# EAGLE design motorcontroller (10.01.2017) (EAGLE 8.3.2)
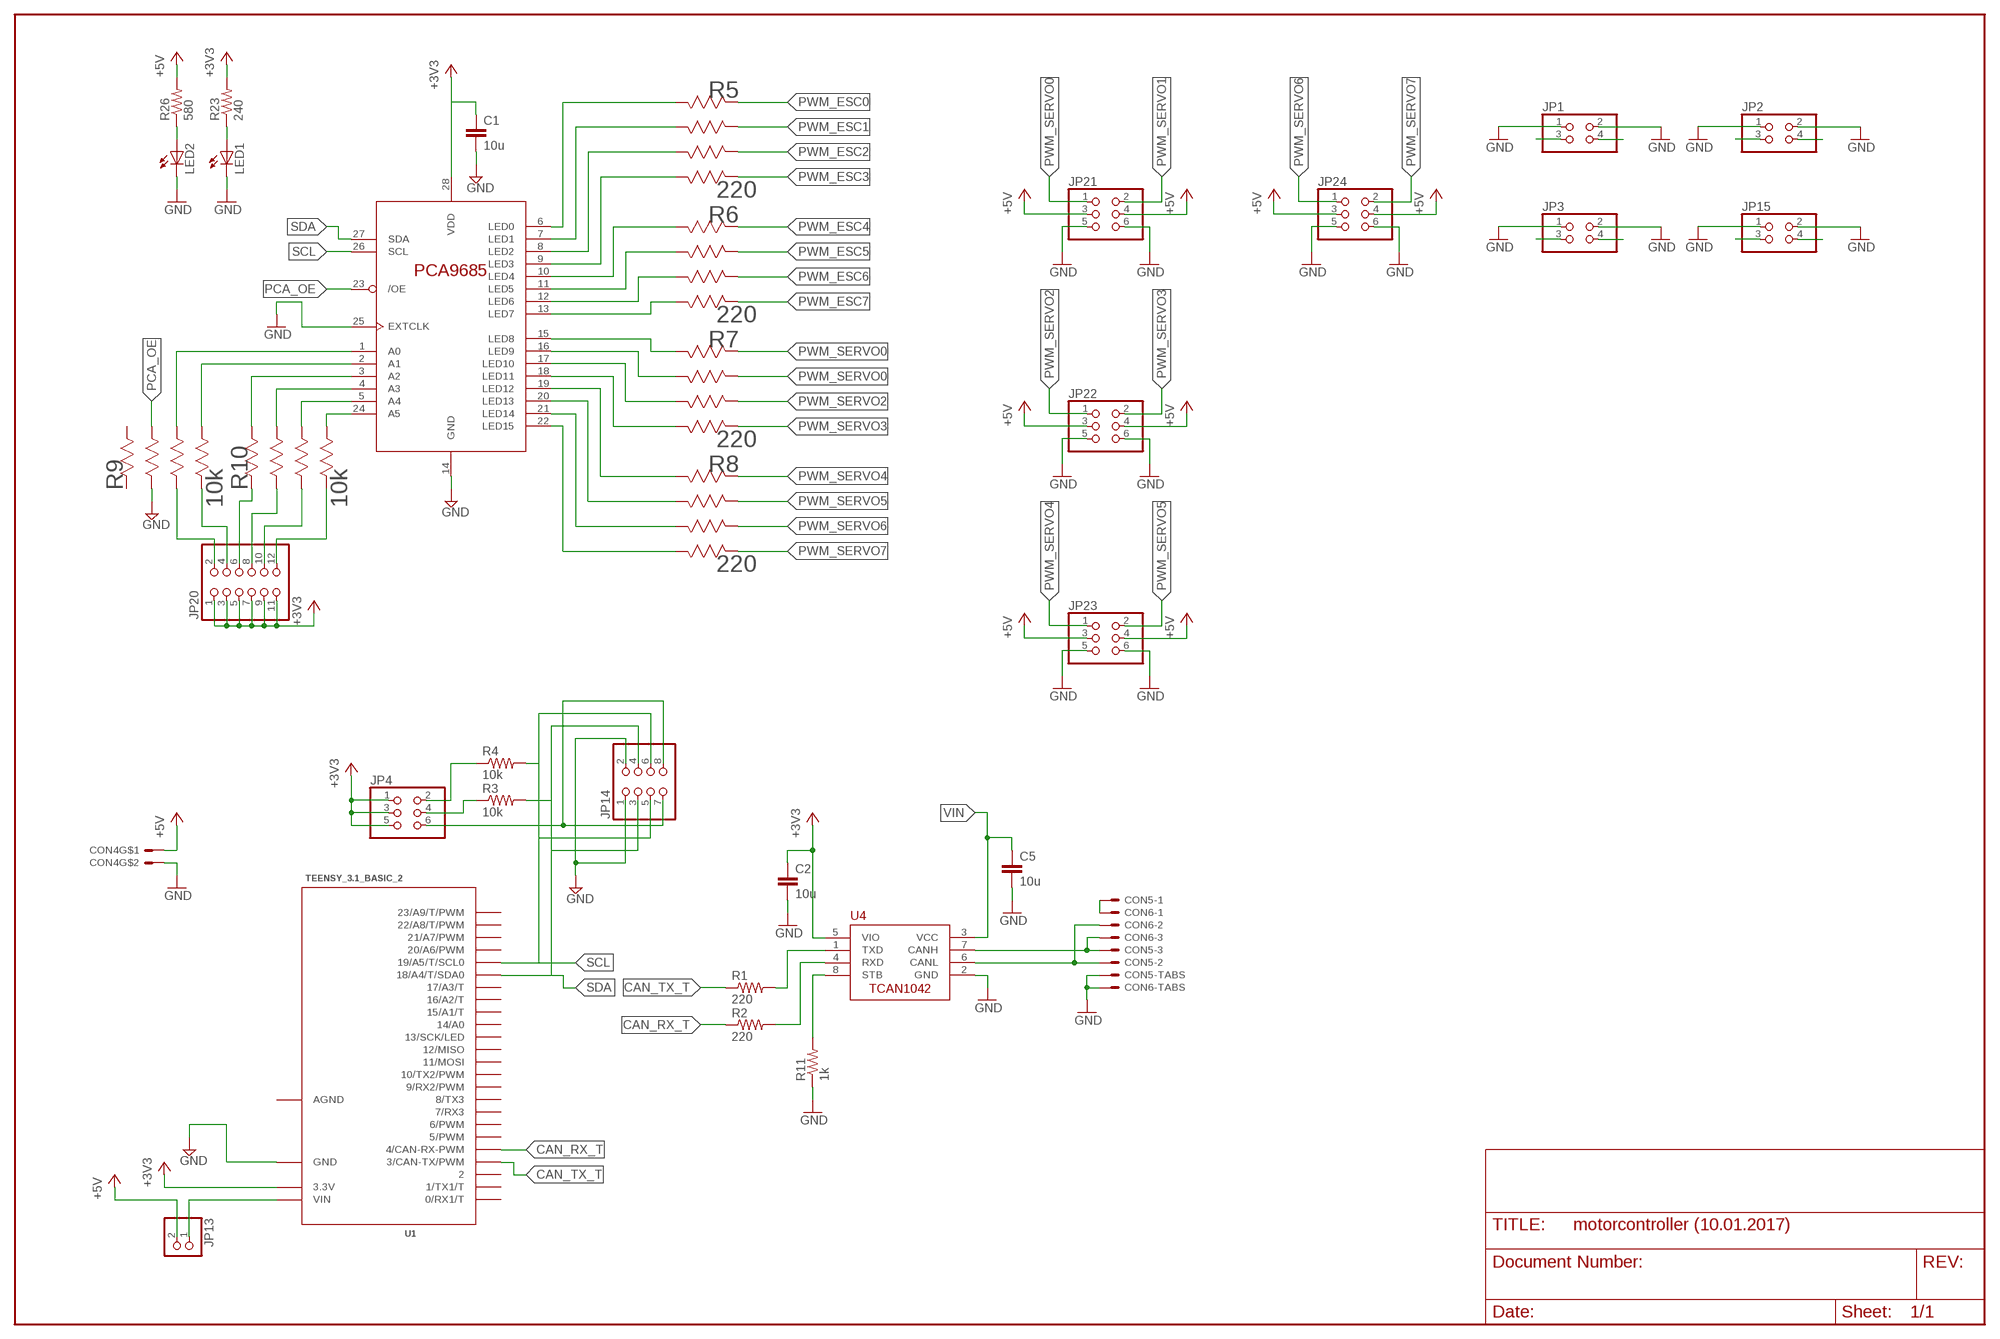
[diagram p0: schematic, sheet 1]

## Parts
C1  10u  C-EUC0805  [C0805]
C2  10u  C-EUC0805  [C0805]
C5  10u  C-EUC0805  [C0805]
CON4  MOLEX_5566-2  [5566-2]
CON5  S3B-PH-SM4-TB  [S3B-PH-SM4-TB]
CON6  S3B-PH-SM4-TB  [S3B-PH-SM4-TB]
JP1  PINHD-2X2  [2X02]
JP2  PINHD-2X2  [2X02]
JP3  PINHD-2X2  [2X02]
JP4  PINHD-2X3  [2X03]
JP13  PINHD-1X2  [1X02]
JP14  PINHD-2X4  [2X04]
JP15  PINHD-2X2  [2X02]
JP20  PINHD-2X6  [2X06]
JP21  PINHD-2X3  [2X03]
JP22  PINHD-2X3  [2X03]
JP23  PINHD-2X3  [2X03]
JP24  PINHD-2X3  [2X03]
LED1  LEDCHIPLED_1206  [CHIPLED_1206]
LED2  LEDCHIPLED_1206  [CHIPLED_1206]
R1  220  R-US_R0805  [R0805]
R2  220  R-US_R0805  [R0805]
R3  10k  R-US_R1206  [R1206]
R4  10k  R-US_R1206  [R1206]
R5  220  EXB-V8V221JVEXBV8V-M  [EXBV8V-M]
R6  220  EXB-V8V221JVEXBV8V-M  [EXBV8V-M]
R7  220  EXB-V8V221JVEXBV8V-M  [EXBV8V-M]
R8  220  EXB-V8V221JVEXBV8V-M  [EXBV8V-M]
R9  10k  EXB-V8V221JVEXBV8V-M  [EXBV8V-M]
R10  10k  EXB-V8V221JVEXBV8V-M  [EXBV8V-M]
R11  1k  R-US_R0805  [R0805]
R23  240  R-US_R1206  [R1206]
R26  580  R-US_R1206  [R1206]
U1  TEENSY_3.1_BASIC_2  [TEENSY_3.1_BASIC_2]
U2  PCA9685PW  [TSSOP28]
U4  TCAN1042HVDR  [SO-8]

## Nets
+3V3: C1.1 C2.1 JP4.1 JP4.3 JP4.5 JP20.1 JP20.3 JP20.5 JP20.7 JP20.9 JP20.11 R23.2 U1.3.3V U2.28(VDD) U4.5(VIO)
+5V: CON4.1 JP13.2 JP21.3 JP21.4 JP22.3 JP22.4 JP23.3 JP23.4 JP24.3 JP24.4 R26.2
A0+1: JP20.2 R9.3
A1+1: JP20.4 R9.4
A2+1: JP20.6 R10.1
A3+1: JP20.8 R10.2
A4+1: JP20.10 R10.3
A5: JP20.12 R10.4
A6: R10.5 U2.24(A5)
A7: R10.6 U2.5(A4)
A8: R10.7 U2.4(A3)
A9: R10.8 U2.3(A2)
A10: R9.5 U2.2(A1)
A11: R9.6 U2.1(A0)
CAN_RX1: R2.2 U4.4(RXD)
CAN_RX_T: R2.1 U1.4(4/CAN-RX-PWM)
CAN_TX2: R1.2 U4.1(TXD)
CAN_TX_T: R1.1 U1.3(3/CAN-TX/PWM)
CANH1: CON5.P$3 CON6.P$3 U4.7(CANH)
CANL1: CON5.P$2 CON6.P$2 U4.6(CANL)
CANSH1: CON5.P$1 CON6.P$1
GND: C1.2 C2.2 C5.2 CON4.2 CON5.P$4 CON5.P$5 CON6.P$4 CON6.P$5 JP1.1 JP1.2 JP2.1 JP2.2 JP3.1 JP3.2 JP14.1 JP14.2 JP15.1 JP15.2 JP21.5 JP21.6 JP22.5 JP22.6 JP23.5 JP23.6 JP24.5 JP24.6 LED1.C LED2.C R9.2 R11.1 U1.GND U2.14(GND) U2.25(EXTCLK) U4.2(GND)
I2C_3V1: JP4.6 JP14.7 JP14.8
N$1: LED1.A R23.1
N$2: LED2.A R26.1
PCA_OE: R9.7 U2.23(/OE)
PWM_CH16: R5.8 U2.6(LED0)
PWM_CH17: R5.7 U2.7(LED1)
PWM_CH18: R5.6 U2.8(LED2)
PWM_CH19: R5.5 U2.9(LED3)
PWM_CH20: R6.8 U2.10(LED4)
PWM_CH21: R6.7 U2.11(LED5)
PWM_CH22: R6.6 U2.12(LED6)
PWM_CH23: R6.5 U2.13(LED7)
PWM_CH24: R7.8 U2.15(LED8)
PWM_CH25: R7.7 U2.16(LED9)
PWM_CH26: R7.6 U2.17(LED10)
PWM_CH27: R7.5 U2.18(LED11)
PWM_CH28: R8.8 U2.19(LED12)
PWM_CH29: R8.7 U2.20(LED13)
PWM_CH30: R8.6 U2.21(LED14)
PWM_CH31: R8.5 U2.22(LED15)
PWM_ESC0: JP15.4 R5.1
PWM_ESC1: JP15.3 R5.2
PWM_ESC2: JP1.4 R5.3
PWM_ESC3: JP1.3 R5.4
PWM_ESC4: JP2.4 R6.1
PWM_ESC5: JP2.3 R6.2
PWM_ESC6: JP3.4 R6.3
PWM_ESC7: JP3.3 R6.4
PWM_SERVO0: JP21.1 R7.1
PWM_SERVO1: JP21.2 R7.2
PWM_SERVO2: JP22.1 R7.3
PWM_SERVO3: JP22.2 R7.4
PWM_SERVO4: JP23.1 R8.1
PWM_SERVO5: JP23.2 R8.2
PWM_SERVO6: JP24.1 R8.3
PWM_SERVO7: JP24.2 R8.4
SCL: JP14.5 JP14.6 R4.2 U1.19/A5(19/A5/T/SCL0) U2.26(SCL)
SCL_3V1: JP4.2 R4.1
SDA: JP14.3 JP14.4 R3.2 U1.18/A4(18/A4/T/SDA0) U2.27(SDA)
SDA_3V1: JP4.4 R3.1
STB1: R11.2 U4.8(STB)
VIN: C5.1 JP13.1 U1.VIN U4.3(VCC)
Unconnected: R9.1 R9.8 U1.0(0/RX1/T) U1.1(1/TX1/T) U1.2 U1.5(5/PWM) U1.6(6/PWM) U1.7(7/RX3) U1.8(8/TX3) U1.9(9/RX2/PWM) U1.10(10/TX2/PWM) U1.11(11/MOSI) U1.12(12/MISO) U1.13(13/SCK/LED) U1.14/A0 U1.15/A1(15/A1/T) U1.16/A2(16/A2/T) U1.17/A3(17/A3/T) U1.20/A6(20/A6/PWM) U1.21/A7(21/A7/PWM) U1.22/A8(22/A8/T/PWM) U1.23/A9(23/A9/T/PWM)

## Power pins joined to a net without a drawn wire
AGND: U1.AGND

## Library data of the parts
C1 C2 C5 = rcl:C-EU: CAPACITOR, European symbol
CON4 = ARVP:MOLEX_5566-2
CON5 CON6 = ARVP:S3B-PH-SM4-TB
JP1-JP3 JP15 = pinhead:PINHD-2X2: PIN HEADER
JP4 JP21-JP24 = pinhead:PINHD-2X3: PIN HEADER
JP13 = pinhead:PINHD-1X2: PIN HEADER
JP14 = pinhead:PINHD-2X4: PIN HEADER
JP20 = pinhead:PINHD-2X6: PIN HEADER
LED1 LED2 = led:LED: LED OSRAM: - CHIPLED LG R971, LG N971, LY N971, LG Q971, LY Q971, LO R971, LY R971 LH N974, LH R974 LS Q976, LO Q976, LY Q976 LO Q996 - Hyper CHIPLED LW Q18S LB Q993, LB Q99A, LB R99A - SideLED LS A670, LO A670, LY A670, LG A670, LP A670 LB A673, LV A673, LT A673, LW A673 LH A674 LY A675 LS A676, LA A676, LO A676, LY A676, LW A676 LS A679, LY A679, LG A679 - Hyper Micro SIDELED® LS Y876, LA Y876, LO Y876, LY Y876 LT Y87S - SmartLED LW L88C, LW L88S LB L89C, LB L89S, LG L890 LS L89K, LO L89K, LY L89K LS L896, LA L896, LO L896, LY L896 - TOPLED LS T670, LO T670, LY T670, LG T670, LP T670 LSG T670, LSP T670, LSY T670, LOP T670, LYG T670 LG T671, LOG T671, LSG T671 LB T673, LV T673, LT T673, LW T673 LH T674 LS T676, LA T676, LO T676, LY T676, LB T676, LH T676, LSB T676, LW T676 LB T67C, LV T67C, LT T67C, LS T67K, LO T67K, LY T67K, LW E67C LS E67B, LA E67B, LO E67B, LY E67B, LB E67C, LV E67C, LT E67C LW T67C LS T679, LY T679, LG T679 LS T770, LO T770, LY T770, LG T770, LP T770 LB T773, LV T773, LT T773, LW T773 LH T774 LS E675, LA E675, LY E675, LS T675 LS T776, LA T776, LO T776, LY T776, LB T776 LHGB T686 LT T68C, LB T68C - Hyper Mini TOPLED® LB M676 - Mini TOPLED Santana® LG M470 LS M47K, LO M47K, LY M47K Source: http://www.osram.convergy.de LUXEON: - LUMILED® LXK2-PW12-R00, LXK2-PW12-S00, LXK2-PW14-U00, LXK2-PW14-V00 LXK2-PM12-R00, LXK2-PM12-S00, LXK2-PM14-U00 LXK2-PE12-Q00, LXK2-PE12-R00, LXK2-PE12-S00, LXK2-PE14-T00, LXK2-PE14-U00 LXK2-PB12-K00, LXK2-PB12-L00, LXK2-PB12-M00, LXK2-PB14-N00, LXK2-PB14-P00, LXK2-PB14-Q00 LXK2-PR12-L00, LXK2-PR12-M00, LXK2-PR14-Q00, LXK2-PR14-R00 LXK2-PD12-Q00, LXK2-PD12-R00, LXK2-PD12-S00 LXK2-PH12-R00, LXK2-PH12-S00 LXK2-PL12-P00, LXK2-PL12-Q00, LXK2-PL12-R00 Source: www.luxeon.com KINGBRIGHT: KA-3528ASYC Source: www.kingbright.com
R1-R4 R11 R23 R26 = rcl:R-US_: RESISTOR, American symbol
R5-R10 = ARVP:EXB-V8V221JV; MANUFACTURER_PART_NUMBER: EXBV8V221JV; VENDOR: Panasonic
U1 = Teensy_3_Series_Board_v1.0:TEENSY_3.1_BASIC_2: Footprint for Teensy 3.1 board using all pin connections on the outer perimeter
U2 = dropper_torpedo_v3:PCA9685
U4 = ARVP:TCAN1042HVDR

## Net classes
1 net1: clearance 0.203 mm to class 0

## Board
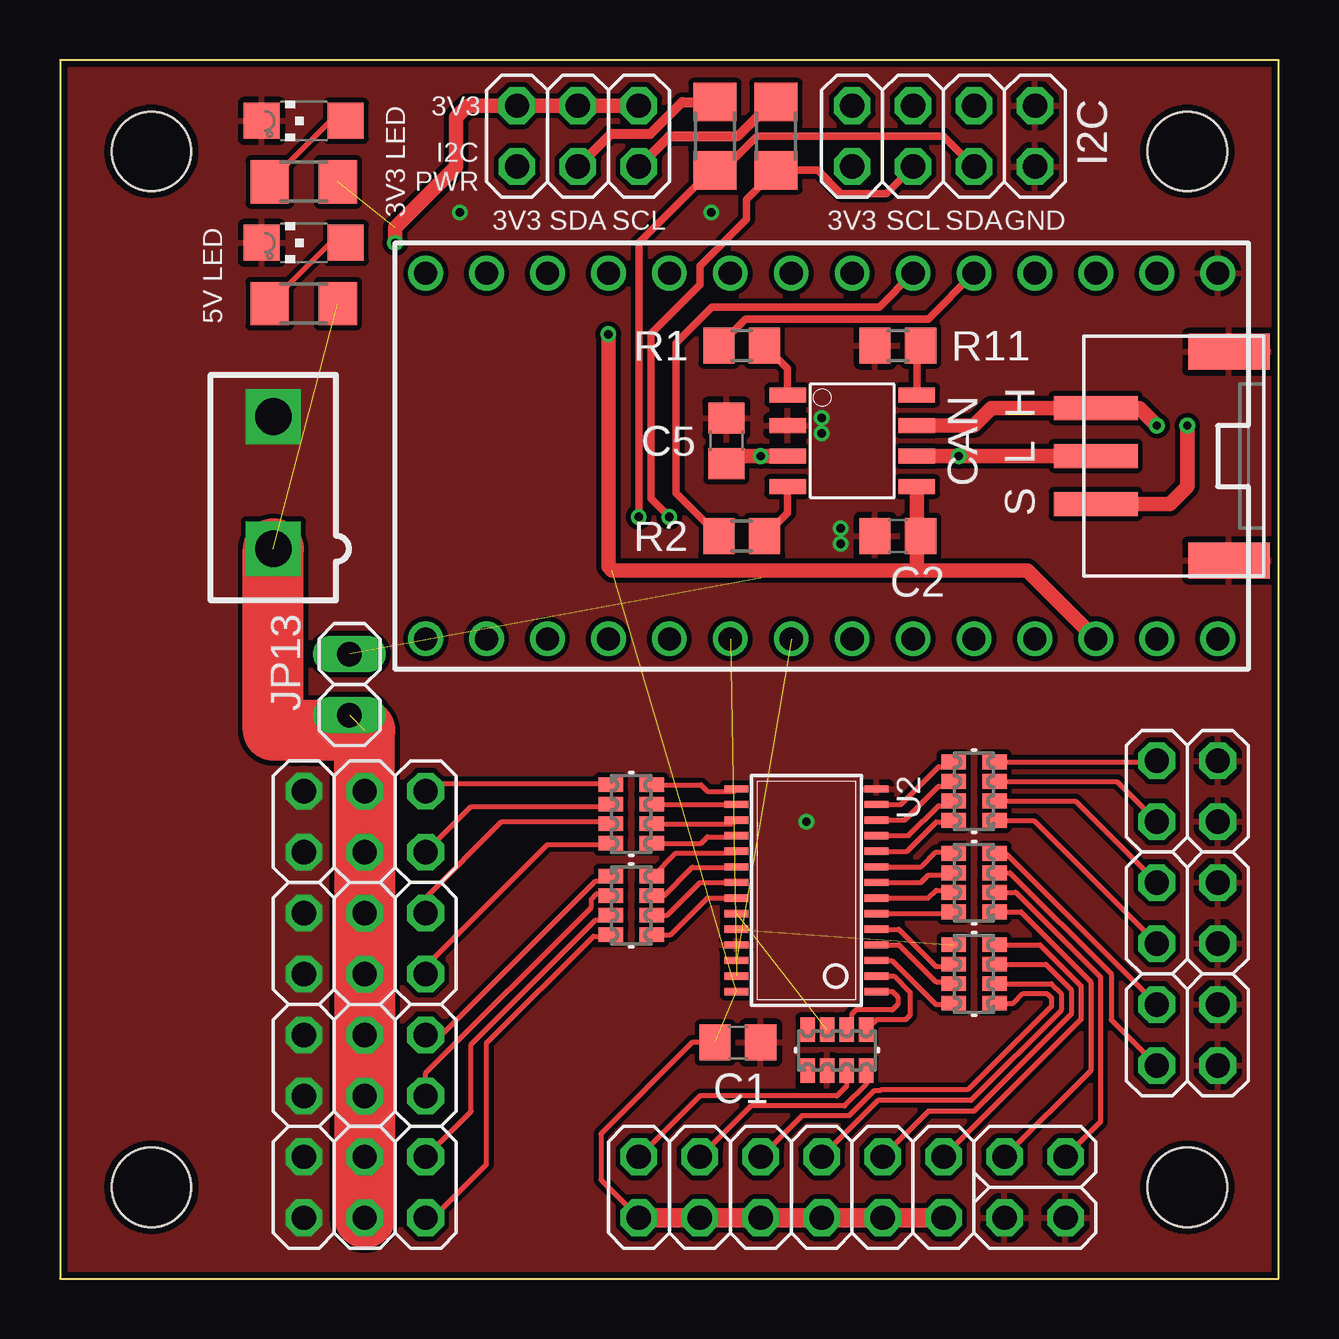
[diagram p1: board, top side]
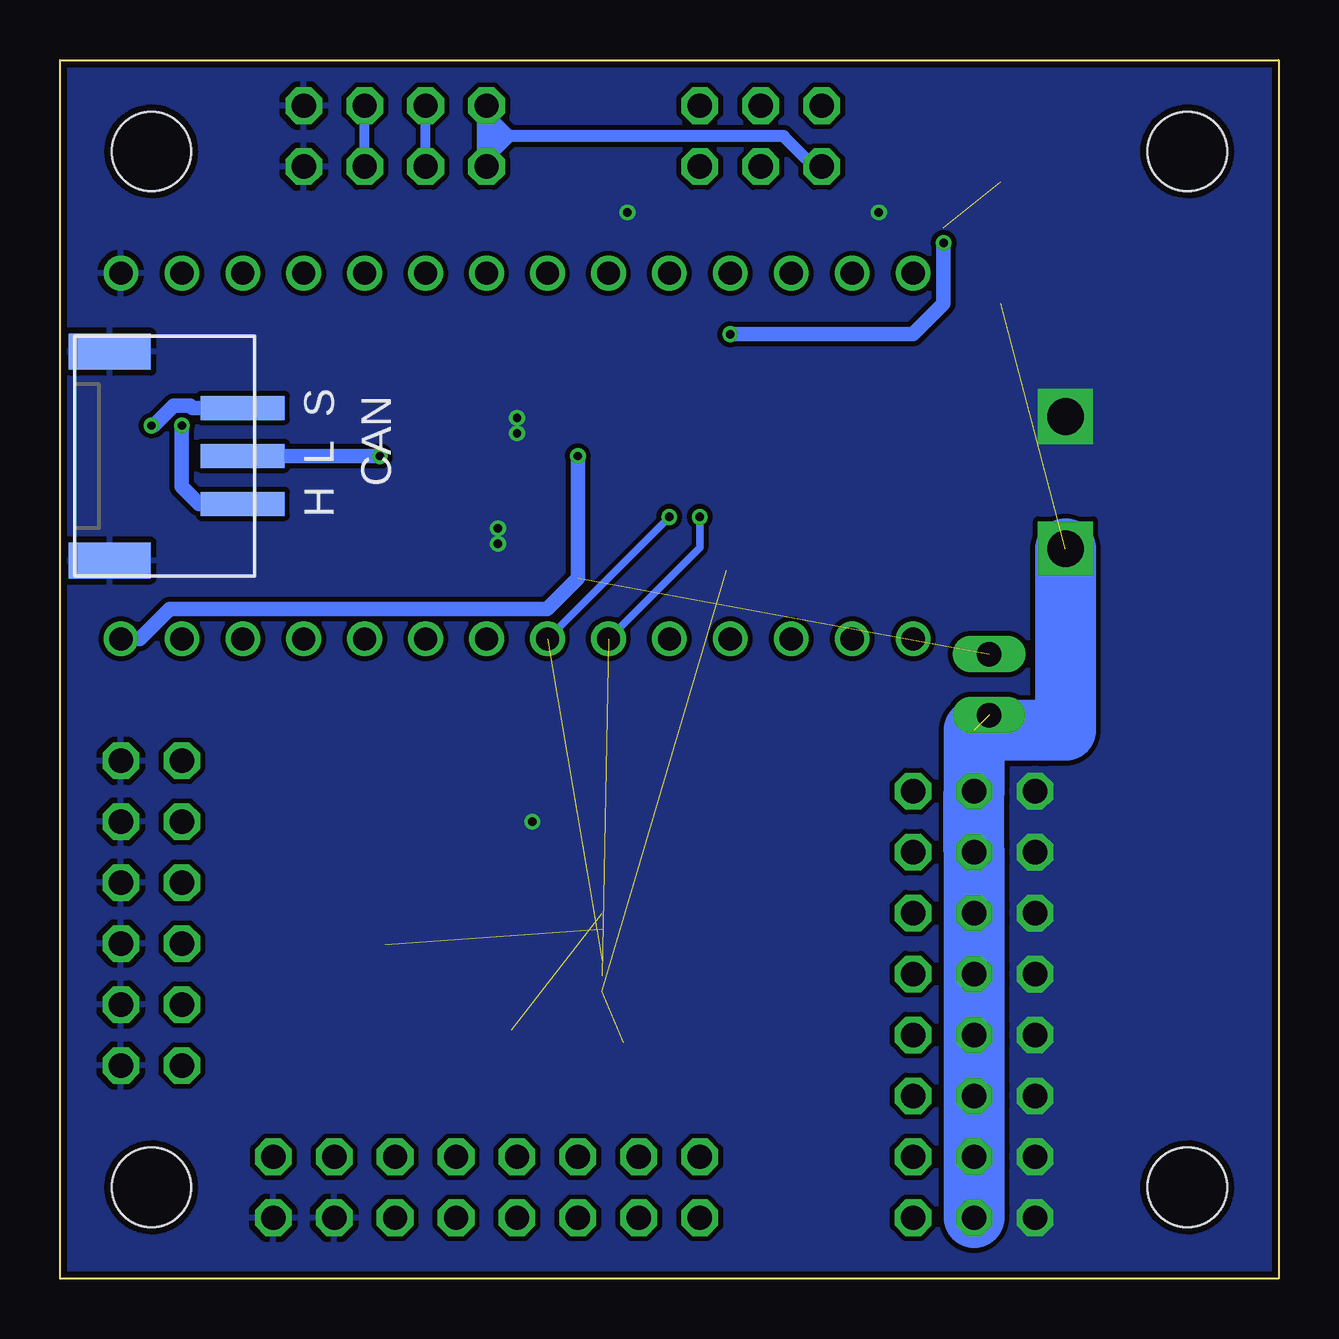
[diagram p2: board, bottom side, seen from below]

Size 50.8 x 50.8 mm. Coordinates in mm from the lower left corner, seen from the top.
Outline: 0,0 50.8,0 50.8,50.8 0,50.8 0,0
Copper layers (1*16): Top 0.035mm / dielectric 1.5mm / Bottom 0.035mm
Design rules "ITEADstudioDRC": minimum track width 6mil, minimum drill 12mil, track to track 8mil, track to pad 8mil, pad to pad 8mil, via to via 8mil, smd to smd 0mil, copper to edge 10mil, drill to drill 10mil, minimum pad ring 6mil, minimum via ring 6mil, stop-mask expansion 2mil, vias tented up to drill 100mil, thermal gap 10mil
Milling: 4 lines

### Footprints (pad centres in the part's own frame; a part is rotated, then mirrored left to right if it is on the bottom)
C0805 = smd 1.3 x 1.5: 1 -0.95,0; 2 0.95,0
5566-2 = drill 1.524 square: 1 0,-2.756; 2 0,2.756
S3B-PH-SM4-TB = smd 1 x 3.5: P$1 -2,1.75; P$2 0,1.75; P$3 2,1.75 | smd 1.5 x 3.4: P$4 4.35,-3.8; P$5 -4.35,-3.8
2X02 = drill 1.016 octagon: 1 -1.27,-1.27; 2 -1.27,1.27; 3 1.27,-1.27; 4 1.27,1.27
2X03 = drill 1.016 octagon: 1 -2.54,-1.27; 2 -2.54,1.27; 3 0,-1.27; 4 0,1.27; 5 2.54,-1.27; 6 2.54,1.27
1X02 = drill 1.016 long: 1 -1.27,0; 2 1.27,0
2X04 = drill 1.016 octagon: 1 -3.81,-1.27; 2 -3.81,1.27; 3 -1.27,-1.27; 4 -1.27,1.27; 5 1.27,-1.27; 6 1.27,1.27; 7 3.81,-1.27; 8 3.81,1.27
2X06 = drill 1.016 octagon: 1 -6.35,-1.27; 2 -6.35,1.27; 3 -3.81,-1.27; 4 -3.81,1.27; 5 -1.27,-1.27; 6 -1.27,1.27; 7 1.27,-1.27; 8 1.27,1.27; 9 3.81,-1.27; 10 3.81,1.27; 11 6.35,-1.27; 12 6.35,1.27
CHIPLED_1206 = smd 1.5 x 1.5: A 0,-1.75; C 0,1.75
R0805 = smd 1.3 x 1.5: 1 -0.95,0; 2 0.95,0
R1206 = smd 1.6 x 1.803: 1 -1.422,0; 2 1.422,0
EXBV8V-M = smd 1.016 x 0.61: 1 -0.851,1.219; 2 -0.851,0.406; 3 -0.851,-0.406; 4 -0.851,-1.219; 5 0.851,-1.219; 6 0.851,-0.406; 7 0.851,0.406; 8 0.851,1.219
TEENSY_3.1_BASIC_2 = drill 0.965: 0 -7.62,13.97; 1 -7.62,11.43; 2 -7.62,8.89; 3 -7.62,6.35; 3.3V 7.62,11.43; 4 -7.62,3.81; 5 -7.62,1.27; 6 -7.62,-1.27; 7 -7.62,-3.81; 8 -7.62,-6.35; 9 -7.62,-8.89; 10 -7.62,-11.43; 11 -7.62,-13.97; 12 -7.62,-16.51; 13 7.62,-16.51; 14/A0 7.62,-13.97; 15/A1 7.62,-11.43; 16/A2 7.62,-8.89; 17/A3 7.62,-6.35; 18/A4 7.62,-3.81; 19/A5 7.62,-1.27; 20/A6 7.62,1.27; 21/A7 7.62,3.81; 22/A8 7.62,6.35; 23/A9 7.62,8.89; AGND 7.62,13.97; GND -7.62,16.51; VIN 7.62,16.51
TSSOP28 = smd 0.305 x 0.991: 1 -4.225,-2.918; 2 -3.575,-2.918; 3 -2.925,-2.918; 4 -2.275,-2.918; 5 -1.625,-2.918; 6 -0.975,-2.918; 7 -0.325,-2.918; 8 0.325,-2.918; 9 0.975,-2.918; 10 1.625,-2.918; 11 2.275,-2.918; 12 2.925,-2.918; 13 3.575,-2.918; 14 4.225,-2.918; 15 4.225,2.918; 16 3.575,2.918; 17 2.925,2.918; 18 2.275,2.918; 19 1.625,2.918; 20 0.975,2.918; 21 0.325,2.918; 22 -0.325,2.918; 23 -0.975,2.918; 24 -1.625,2.918; 25 -2.275,2.918; 26 -2.925,2.918; 27 -3.575,2.918; 28 -4.225,2.918
SO-8 = smd 1.524 x 0.61: 1 -2.692,1.905; 2 -2.692,0.635; 3 -2.692,-0.635; 4 -2.692,-1.905; 5 2.692,-1.905; 6 2.692,-0.635; 7 2.692,0.635; 8 2.692,1.905
STAND-OFF = hole 3.302: 0,0

### Placement (x,y rotation side)
C1  28.26,9.84 0 top
C2  34.92,30.96 180 top
C5  27.78,34.93 90 top
CON4  8.89,33.18 0 top
CON5  44.93,34.29 90 top
CON6  44.93,34.29 270 bottom
JP1  46.99,10.16 180 top
JP2  46.99,15.24 180 top
JP3  46.99,20.32 180 top
JP4  21.59,47.62 180 top
JP13  12.06,24.77 270 top
JP14  36.83,47.62 180 top
JP15  40.64,3.81 90 top
JP20  30.48,3.81 0 top
JP21  12.7,19.05 180 top
JP22  12.7,13.97 180 top
JP23  12.7,8.89 180 top
JP24  12.7,3.81 180 top
LED1  10.16,48.26 90 top
LED2  10.16,43.18 90 top
R1  28.42,38.89 0 top
R2  28.42,30.96 0 top
R3  27.3,47.62 270 top
R4  29.84,47.62 270 top
R5  38.1,16.51 180 top
R6  38.1,20.32 180 top
R7  23.81,19.37 0 top
R8  23.81,15.56 0 top
R9  32.39,9.53 90 top
R10  38.1,12.7 180 top
R11  34.92,38.89 0 top
R23  10.16,45.72 0 top
R26  10.16,40.64 0 top
U1  31.75,34.29 270 top
U2  31.11,16.19 90 top
U4  33.02,34.93 0 top
U$2  [STAND-OFF]  46.99,3.81 0 top
U$3  [STAND-OFF]  3.81,3.81 0 top
U$4  [STAND-OFF]  3.81,46.99 0 top
U$5  [STAND-OFF]  46.99,46.99 0 top
U$11  [LETTER_L]  -107.95,-78.74 0 top  (outside the outline)
U$12  [DOCFIELD]  39.37,-78.74 0 top  (outside the outline)

### Tracks (layer width: path | path; a pad name or v marks a point on that pad's centre or on a via)
+3V3  (via drill 0.35)  (3 unrouted)
  Top 0.203: C1.1 26.35,9.84 22.54,6.03 22.54,4.13 JP20.1
  Top 0.61: v13.97,43.18 13.97,43.82 16.51,46.36 16.51,48.42 16.99,48.9 JP4.5 JP4.3 JP4.1 | 35.71,31.12 U4.5 | 35.71,31.12 C2.1 35.72,30.8 35.72,29.53 | 35.71,30.96 35.71,31.12 | U1.3.3V 40.32,29.53 35.72,29.53 | 35.72,29.53 23.02,29.53 22.86,29.69 v22.86,39.37
  Top 0.813: JP20.1 JP20.3 JP20.5 JP20.7 JP20.9 JP20.11
  Bottom 0.61: v13.97,43.18 13.97,40.64 15.24,39.37 v22.86,39.37
+5V  (2 unrouted)
  Top 2.54: JP24.4 JP24.3 JP23.4 JP23.3 JP22.4 JP22.3 JP21.4 JP21.3 12.7,22.86 8.89,22.86 CON4.1
  Bottom 2.54: JP24.4 JP24.3 JP23.4 JP23.3 JP22.4 JP22.3 JP21.4 JP21.3 12.7,22.86 8.89,22.86 CON4.1
A0+1
  Top 0.203: R9.3 32.79,8.03 32.39,7.62 26.67,7.62 JP20.2
A1+1
  Top 0.203: R9.4 33.6,8.1 32.7,7.2 28.79,7.2 JP20.4
A2+1
  Top 0.203: R10.1 39.74,11.48 40.14,11.89 41.14,11.89 41.33,11.7 41.33,11.36 37.84,7.88 34.23,7.88 34.19,7.84 33.93,7.84 32.89,6.8 30.93,6.8 JP20.6
A3+1
  Top 0.203: R10.2 41.33,12.29 41.73,11.89 41.73,11.19 37.97,7.43 34.1,7.43 JP20.8
A4+1
  Top 0.203: R10.3 41.09,13.11 42.15,12.05 42.15,11.04 38.1,6.98 36.2,6.98 JP20.10
A5
  Top 0.203: R10.4 40.85,13.92 42.56,12.21 42.56,10.81 JP20.12
A6  (1 unrouted)
A7
  Top 0.203: U2.5 34.96,14.57 36.51,13.02 37.16,13.02 R10.6
A8
  Top 0.203: U2.4 34.98,13.92 36.51,12.38 37.16,12.38 R10.7
A9
  Top 0.203: U2.3 34.67,13.27 36.51,11.43 37.2,11.43 R10.8
A10
  Top 0.203: U2.2 34.75,12.62 35.43,11.94 35.43,10.98 35.24,10.8 34.02,10.8 R9.5
A11
  Top 0.203: U2.1 34.7,11.97 34.92,11.75 34.92,11.43 34.7,11.2 33.19,11.2 32.99,11.01 32.99,10.58 R9.6
CAN_RX1
  Top 0.305: U4.4 30.33,31.92 R2.2
CAN_RX_T
  Top 0.305: U1.4 34.16,40.51 27.18,40.51 25.67,39 25.67,32.75 R2.1
CAN_TX2
  Top 0.305: U4.1 30.33,37.93 R1.2
CAN_TX_T
  Top 0.305: U1.3 36.19,40 28.57,40 28.36,39.79 R1.1
CANH1  (via drill 0.35)
  Top 0.61: U4.7 38.1,35.56 38.83,36.29 CON5.P$3 44.99,36.29 v45.72,35.56
  Bottom 0.61: v45.72,35.56 45.72,33.02 44.99,32.29 CON6.P$3
CANL1  (via drill 0.35)
  Top 0.61: U4.6 v37.46,34.29 CON6.P$2
  Bottom 0.61: v37.46,34.29 CON6.P$2
CANSH1  (via drill 0.35)
  Top 0.61: CON5.P$1 46.26,32.29 46.99,33.02 v46.99,35.56
  Bottom 0.61: v46.99,35.56 46.9,35.56 46.07,36.4 45.37,36.4 45.27,36.29 CON6.P$1
GND  (via drill 0.35)
  other vias: 31.11,19.05 32.54,31.27 32.54,30.64 31.75,35.88 31.75,35.24 16.67,44.45 27.15,44.45
  pour Bottom (rank 2): 0.32,0.32 50.48,0.32 50.48,50.48 0.32,50.48
  pour Top (rank 3): 0.32,0.32 50.48,0.32 50.48,50.48 0.32,50.48
  pour Top (no thermals): 8.89,21.59 11.43,21.59 11.43,1.27 8.89,1.27
  pour Bottom (no thermals): 8.89,21.59 11.43,21.59 11.43,1.27 8.89,1.27
  pour Bottom (no thermals): 6.98,37.47 10.8,37.47 10.8,34.29 6.98,34.29
  pour Top (no thermals): 6.98,37.47 10.8,37.47 10.8,34.29 6.98,34.29
I2C_3V1
  Bottom 0.508: JP4.6 19.37,46.36 20.64,47.62 33.02,47.62 | 33.02,48.58 32.07,47.62 33.02,46.67
  Bottom 0.813: JP14.7 33.02,48.58 33.02,47.62 33.02,46.67 JP14.8
N$1
  Top 0.203: LED1.A 11.28,48.26 R23.1
N$2
  Top 0.203: LED2.A 11.28,43.18 R26.1
PCA_OE  (1 unrouted)
PWM_CH16
  Top 0.203: U2.6 37.18,15.22 R5.8
PWM_CH17
  Top 0.203: U2.7 36.19,15.87 36.51,16.19 37.16,16.19 R5.7
PWM_CH18
  Top 0.203: U2.8 35.89,16.52 36.2,16.83 37.16,16.83 R5.6
PWM_CH19
  Top 0.203: U2.9 35.9,17.17 36.51,17.78 37.2,17.78 R5.5
PWM_CH20
  Top 0.203: U2.10 35.3,17.82 36.52,19.04 37.19,19.04 R6.8
PWM_CH21
  Top 0.203: R6.7 37.05,19.71 36.61,19.71 35.37,18.47 U2.11
PWM_CH22
  Top 0.203: R6.6 37.05,20.52 36.61,20.52 35.21,19.12 U2.12
PWM_CH23
  Top 0.203: R6.5 37.05,21.34 36.61,21.34 35.05,19.77 U2.13
PWM_CH24
  Top 0.203: R7.8 26.72,20.59 26.99,20.32 28.1,20.32 U2.15
PWM_CH25
  Top 0.203: R7.7 U2.16
PWM_CH26
  Top 0.203: R7.6 28.04,18.96 U2.17
PWM_CH27
  Top 0.203: R7.5 26.72,18.15 26.99,18.42 28.14,18.42 U2.18
PWM_CH28
  Top 0.203: R8.8 24.71,16.78 25.68,17.74 28.12,17.74 U2.19
PWM_CH29
  Top 0.203: R8.7 25.17,15.96 26.35,17.15 28.17,17.15 U2.20
PWM_CH30
  Top 0.203: R8.6 25.31,15.15 26.67,16.51 U2.21
PWM_CH31
  Top 0.203: R8.5 25.45,14.34 26.99,15.88 U2.22
PWM_ESC0
  Top 0.203: R5.1 40.05,15.29 42.96,12.38 42.96,8.67 JP15.4
PWM_ESC1
  Top 0.203: R5.2 39.84,16.1 43.37,12.57 43.37,6.54 JP15.3
PWM_ESC2
  Top 0.203: R5.3 39.6,16.92 43.81,12.7 43.81,10.8 JP1.4
PWM_ESC3
  Top 0.203: R5.4 39.42,17.73 JP1.3
PWM_ESC4
  Top 0.203: R6.1 40.59,19.1 JP2.4
PWM_ESC5
  Top 0.203: R6.2 42.32,19.91 JP2.3
PWM_ESC6
  Top 0.203: R6.3 44.04,20.73 JP3.4
PWM_ESC7
  Top 0.203: R6.4 45.67,21.54 JP3.3
PWM_SERVO0
  Top 0.203: JP21.1 15.56,20.32 15.88,20.64 22.91,20.64 R7.1
PWM_SERVO1
  Top 0.203: JP21.2 17.14,19.69 22.87,19.69 R7.2
PWM_SERVO2
  Top 0.203: JP22.1 15.24,15.88 18.41,19.05 22.87,19.05 R7.3
PWM_SERVO3
  Top 0.203: JP22.2 15.24,13.02 20.32,18.1 22.91,18.1 R7.4
PWM_SERVO4
  Top 0.203: R8.1 22.76,16.57 22.33,16.57 15.91,10.16 JP23.1
PWM_SERVO5
  Top 0.203: JP23.2 15.24,8.57 22.15,15.48 22.15,15.82 22.37,16.04 22.88,16.04 R8.2
PWM_SERVO6
  Top 0.203: JP24.1 17.14,6.98 17.14,9.77 22.33,14.95 22.76,14.95 R8.3
PWM_SERVO7
  Top 0.203: JP24.2 15.56,2.54 17.78,4.76 17.78,9.83 22.23,14.28 22.9,14.28 R8.4
SCL  (via drill 0.35)  (1 unrouted)
  Top 0.305: v25.4,31.75 24.64,32.51 24.64,39.4 26.67,41.43 26.67,42.21 28.62,44.17 28.62,44.98 R4.2 31.59,46.2 32.56,45.24 34.44,45.24 JP14.6
  Bottom 0.305: v25.4,31.75 U1.19/A5
  Bottom 0.406: JP14.6 JP14.5
SCL_3V1
  Top 0.406: JP4.2 25.4,47.62 28.26,47.62 29.68,49.05 R4.1
SDA  (via drill 0.35)  (1 unrouted)
  Top 0.305: v24.13,31.75 24.13,43.18 27.15,46.2 R3.2 27.63,46.2 29.05,47.62 36.83,47.62 JP14.4
  Bottom 0.305: v24.13,31.75 24.13,30.48 U1.18/A4
  Bottom 0.406: JP14.4 JP14.3
SDA_3V1
  Top 0.406: JP4.4 22.96,47.73 24.61,47.73 25.93,49.05 R3.1
STB1
  Top 0.305: R11.2 35.71,38.73 U4.8
VIN  (via drill 0.35)  (1 unrouted)
  Top 0.61: C5.1 27.94,34.29 v29.21,34.29 U4.3 30.48,34.29
  Bottom 0.61: U1.VIN 47.48,26.67 46.24,27.92 30.51,27.92 29.21,29.21 v29.21,34.29

### Text on the board
tNames: 3V3 LED | 3V3 | I2C | I2C / PWR | 5V LED | 3V3 | SDA | SCL | 3V3 | SCL | SDA | GND | H | CAN | L | S | SHORT JP11 / WHEN USB NOT / IN USE
bNames: S | CAN | L | H
tDocu: Assumptions: this board is installed in right/rear or left/front section of robot. / Teensy USB connector and CAN connector should point towards the center of hull. / Mounting holes come from Sparkfun library, located in projects folder. / Layout can be changed if needed, as long as USB and CAN guidelines are followed. | Towards acrylic wall | Towards middle of robot | Bottom | Bottom